# Altium schematic sheet GPIO_LED.SchDoc: GPIO LEDs
size A; Author: James Thomas; CompanyName: BYUI; DrawnBy: James Thomas; Engineer: James Thomas; Organization: CSEE; DocumentNumber: 15; Revision: 0.0.1; SheetNumber: 15; SheetTotal: 15
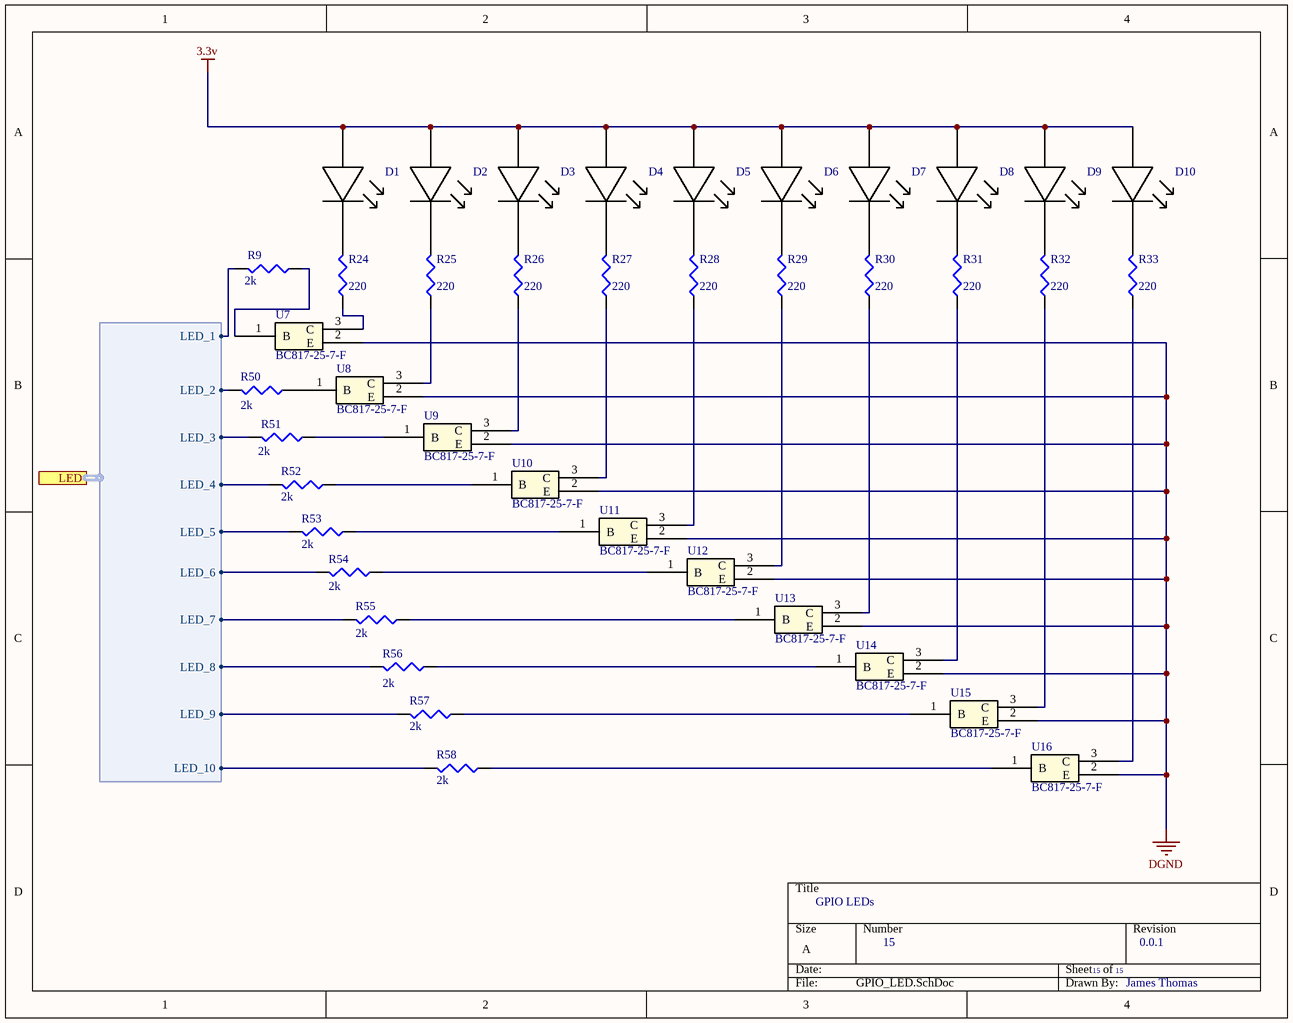
[diagram p0: GPIO_LED.SchDoc]

## Parts
D1  LP T67F-P1R2-35-1-20-R18-Z  [LP T67F-P1R2-35-1-20-R18-Z]  (value not drawn)
D2  LP T67F-P1R2-35-1-20-R18-Z  [LP T67F-P1R2-35-1-20-R18-Z]  (value not drawn)
D3  LP T67F-P1R2-35-1-20-R18-Z  [LP T67F-P1R2-35-1-20-R18-Z]  (value not drawn)
D4  LP T67F-P1R2-35-1-20-R18-Z  [LP T67F-P1R2-35-1-20-R18-Z]  (value not drawn)
D5  LP T67F-P1R2-35-1-20-R18-Z  [LP T67F-P1R2-35-1-20-R18-Z]  (value not drawn)
D6  LP T67F-P1R2-35-1-20-R18-Z  [LP T67F-P1R2-35-1-20-R18-Z]  (value not drawn)
D7  LP T67F-P1R2-35-1-20-R18-Z  [LP T67F-P1R2-35-1-20-R18-Z]  (value not drawn)
D8  LP T67F-P1R2-35-1-20-R18-Z  [LP T67F-P1R2-35-1-20-R18-Z]  (value not drawn)
D9  LP T67F-P1R2-35-1-20-R18-Z  [LP T67F-P1R2-35-1-20-R18-Z]  (value not drawn)
D10  LP T67F-P1R2-35-1-20-R18-Z  [LP T67F-P1R2-35-1-20-R18-Z]  (value not drawn)
R9  value 2k  [J1-0603]  (hidden comment: Res3)
R24  value 220  [J1-0603]  (hidden comment: Res3)
R25  value 220  [J1-0603]  (hidden comment: Res3)
R26  value 220  [J1-0603]  (hidden comment: Res3)
R27  value 220  [J1-0603]  (hidden comment: Res3)
R28  value 220  [J1-0603]  (hidden comment: Res3)
R29  value 220  [J1-0603]  (hidden comment: Res3)
R30  value 220  [J1-0603]  (hidden comment: Res3)
R31  value 220  [J1-0603]  (hidden comment: Res3)
R32  value 220  [J1-0603]  (hidden comment: Res3)
R33  value 220  [J1-0603]  (hidden comment: Res3)
R50  value 2k  [J1-0603]  (hidden comment: Res3)
R51  value 2k  [J1-0603]  (hidden comment: Res3)
R52  value 2k  [J1-0603]  (hidden comment: Res3)
R53  value 2k  [J1-0603]  (hidden comment: Res3)
R54  value 2k  [J1-0603]  (hidden comment: Res3)
R55  value 2k  [J1-0603]  (hidden comment: Res3)
R56  value 2k  [J1-0603]  (hidden comment: Res3)
R57  value 2k  [J1-0603]  (hidden comment: Res3)
R58  value 2k  [J1-0603]  (hidden comment: Res3)
U7  BC817-25-7-F  [*SOT23]
U8  BC817-25-7-F  [*SOT23]
U9  BC817-25-7-F  [*SOT23]
U10  BC817-25-7-F  [*SOT23]
U11  BC817-25-7-F  [*SOT23]
U12  BC817-25-7-F  [*SOT23]
U13  BC817-25-7-F  [*SOT23]
U14  BC817-25-7-F  [*SOT23]
U15  BC817-25-7-F  [*SOT23]
U16  BC817-25-7-F  [*SOT23]

## Ports
LED (harness LED)

## Harnesses
LED: LED_1, LED_2, LED_3, LED_4, LED_5, LED_6, LED_7, LED_8, LED_9, LED_10

## Nets
3.3v: D1.A D2.A D3.A D4.A D5.A D6.A D7.A D8.A D9.A D10.A
DGND: U7.2(E) U8.2(E) U9.2(E) U10.2(E) U11.2(E) U12.2(E) U13.2(E) U14.2(E) U15.2(E) U16.2(E)
NetD1_C: D1.C R24.2
NetD2_C: D2.C R25.2
NetD3_C: D3.C R26.2
NetD4_C: D4.C R27.2
NetD5_C: D5.C R28.2
NetD6_C: D6.C R29.2
NetD7_C: D7.C R30.2
NetD8_C: D8.C R31.2
NetD9_C: D9.C R32.2
NetD10_C: D10.C R33.2
NetR9_1: R9.1 U7.1(B)
NetR9_2: R9.2 ; port LED.LED_1
NetR24_1: R24.1 U7.3(C)
NetR25_1: R25.1 U8.3(C)
NetR26_1: R26.1 U9.3(C)
NetR27_1: R27.1 U10.3(C)
NetR28_1: R28.1 U11.3(C)
NetR29_1: R29.1 U12.3(C)
NetR30_1: R30.1 U13.3(C)
NetR31_1: R31.1 U14.3(C)
NetR32_1: R32.1 U15.3(C)
NetR33_1: R33.1 U16.3(C)
NetR50_1: R50.1 U8.1(B)
NetR50_2: R50.2 ; port LED.LED_2
NetR51_1: R51.1 U9.1(B)
NetR51_2: R51.2 ; port LED.LED_3
NetR52_1: R52.1 U10.1(B)
NetR52_2: R52.2 ; port LED.LED_4
NetR53_1: R53.1 U11.1(B)
NetR53_2: R53.2 ; port LED.LED_5
NetR54_1: R54.1 U12.1(B)
NetR54_2: R54.2 ; port LED.LED_6
NetR55_1: R55.1 U13.1(B)
NetR55_2: R55.2 ; port LED.LED_7
NetR56_1: R56.1 U14.1(B)
NetR56_2: R56.2 ; port LED.LED_8
NetR57_1: R57.1 U15.1(B)
NetR57_2: R57.2 ; port LED.LED_9
NetR58_1: R58.1 U16.1(B)
NetR58_2: R58.2 ; port LED.LED_10

## Library data of the parts
D1-D10 = LP T67F-P1R2-35-1-20-R18-Z: SMD LED
R9 R24-R33 R50-R58 = Res3: Resistor; Published: 8-Jun-2000; LatestRevisionDate: 29-May-2009; LatestRevisionNote: IPC-7351 Footprint Added.; PackageReference: J1-0603; Publisher: Altium Limited; PackageDescription: Chip Resistor
U7-U16 = BC817-25-7-F: NPN Transistor; Vendor: Diodes Inc; Built_By: EMA_UL_Team; Manufacturer_Part_Number: BC817-25-7-F; Copyright: Copyright (C) 2018 Accelerated Designs. All rights reserved; RefDes: RefDes; Type: DEV; Value: Value